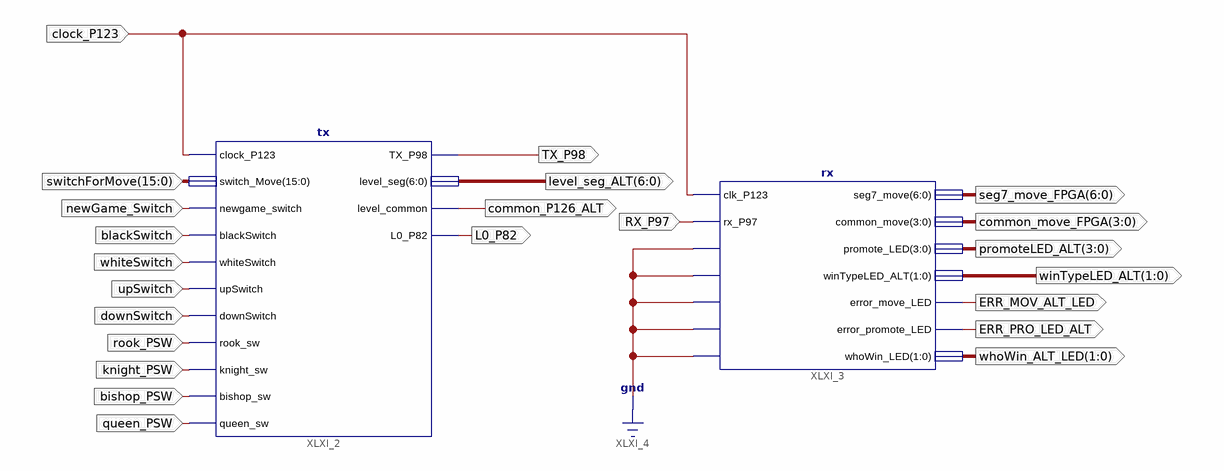
[diagram p0: schematic sheet 1]
// Xilinx ISE schematic mainCircuit.sch (spartan6) as structural Verilog: 2 symbols, 23 ports
module mainCircuit (
  input  clock_P123,
  input  [15:0] switchForMove,
  input  newGame_Switch,
  input  blackSwitch,
  input  whiteSwitch,
  input  upSwitch,
  input  downSwitch,
  input  rook_PSW,
  input  knight_PSW,
  input  bishop_PSW,
  input  queen_PSW,
  input  RX_P97,
  output [6:0] level_seg_ALT,
  output common_P126_ALT,
  output [6:0] seg7_move_FPGA,
  output [3:0] common_move_FPGA,
  output [3:0] promoteLED_ALT,
  output [1:0] winTypeLED_ALT,
  output ERR_MOV_ALT_LED,
  output ERR_PRO_LED_ALT,
  output [1:0] whoWin_ALT_LED,
  output TX_P98,
  output L0_P82
);

  rx XLXI_3 (
    .clear_error_move(1'b0), .clear_Error_Promote(1'b0), .clear_Promote(1'b0), .clear_whoWin(1'b0),
    .clear_winType(1'b0), .clk_P123(clock_P123), .common_move(common_move_FPGA),
    .error_move_LED(ERR_MOV_ALT_LED), .error_promote_LED(ERR_PRO_LED_ALT), .promote_LED(promoteLED_ALT),
    .rx_P97(RX_P97), .seg7_move(seg7_move_FPGA), .whoWin_LED(whoWin_ALT_LED), .winTypeLED_ALT(winTypeLED_ALT));
  tx XLXI_2 (
    .bishop_sw(bishop_PSW), .blackSwitch(blackSwitch), .clock_P123(clock_P123), .downSwitch(downSwitch),
    .knight_sw(knight_PSW), .L0_P82(L0_P82), .level_common(common_P126_ALT), .level_seg(level_seg_ALT),
    .newgame_switch(newGame_Switch), .queen_sw(queen_PSW), .rook_sw(rook_PSW), .switch_Move(switchForMove),
    .TX_P98(TX_P98), .upSwitch(upSwitch), .whiteSwitch(whiteSwitch));
endmodule
